# EAGLE design placappal (EAGLE 6.6.0)
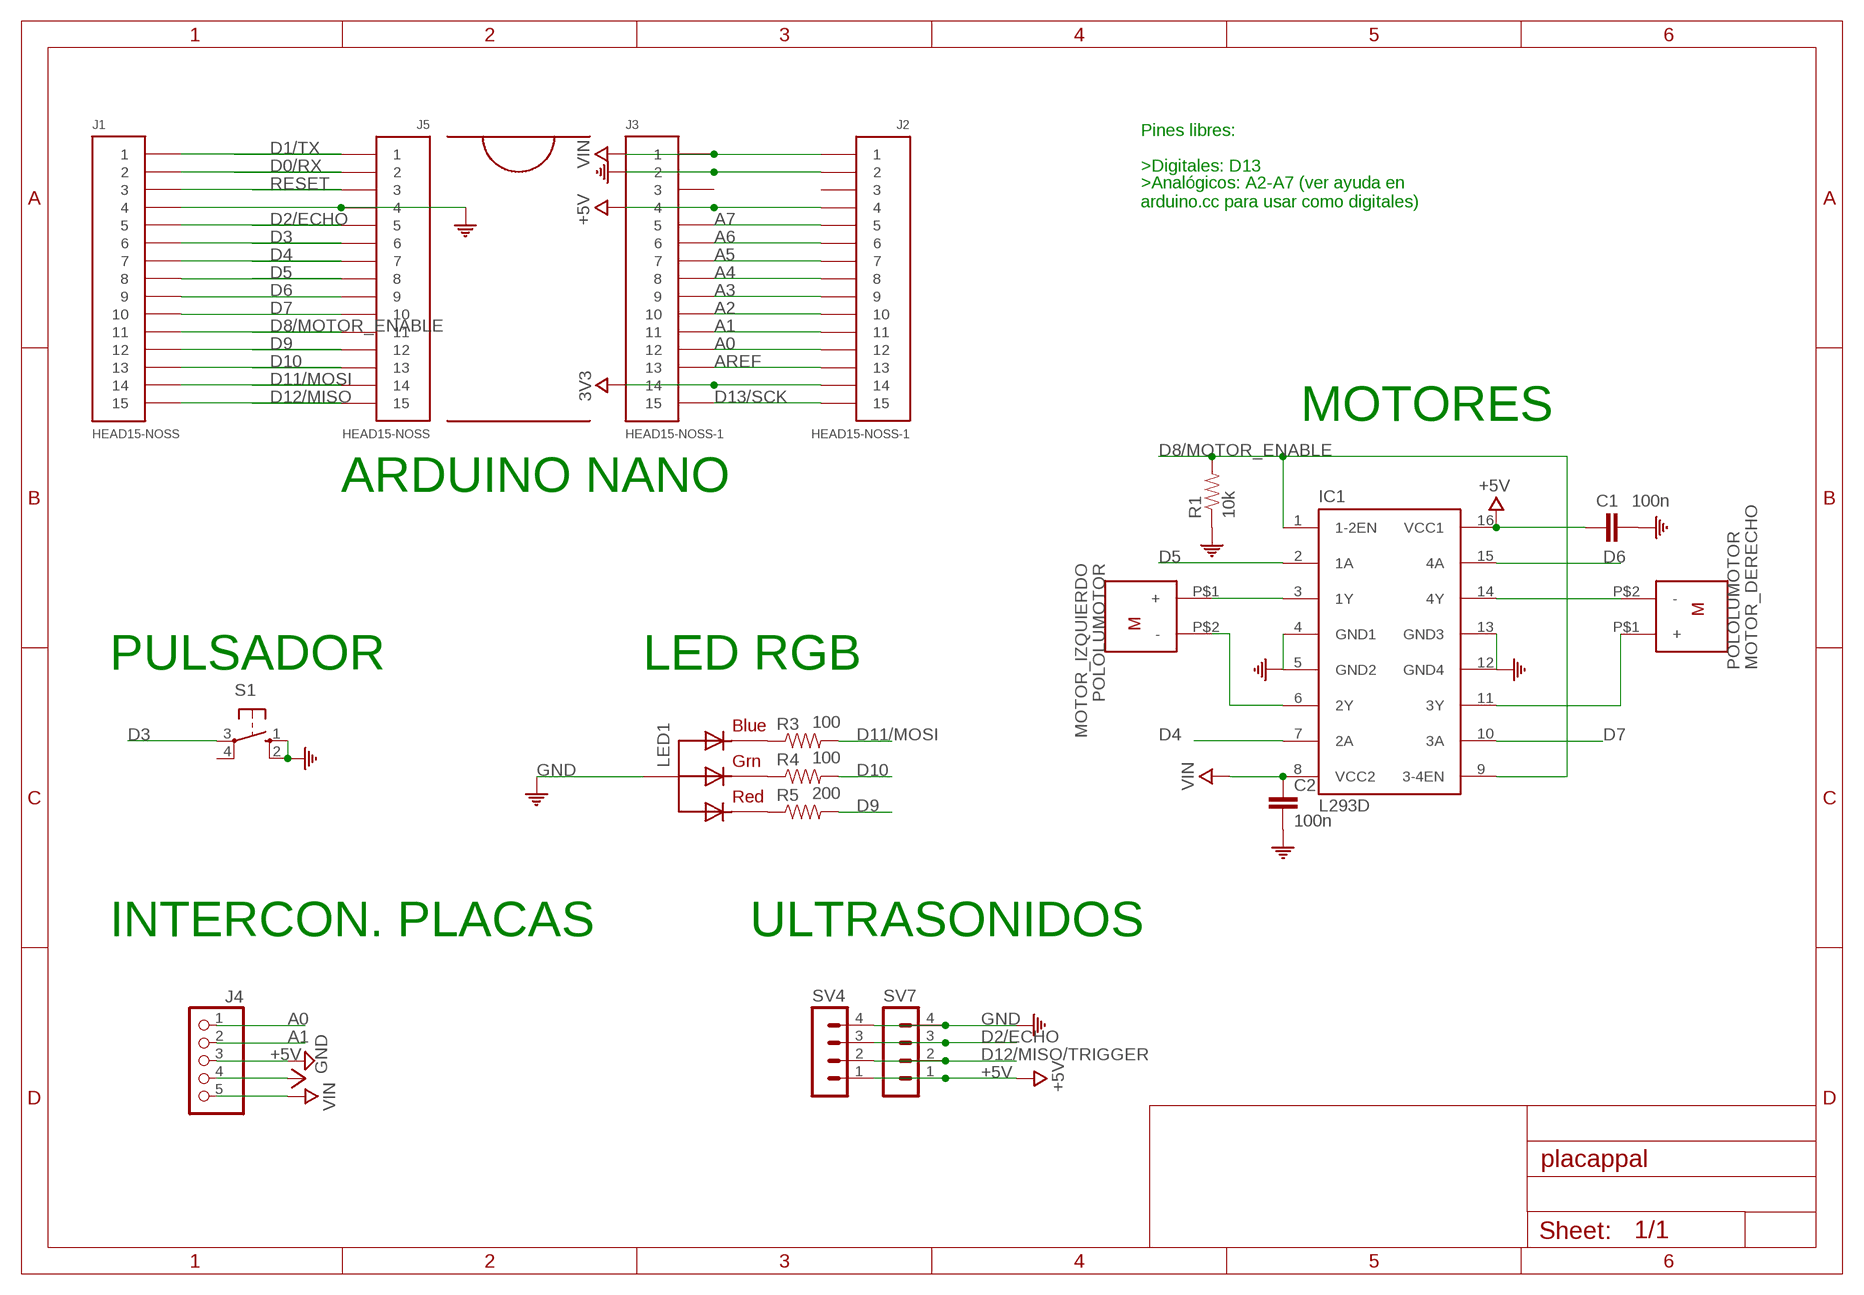
[diagram p0: schematic, sheet 1]

## Parts
C1  100n  CAP1206  [1206]
C2  100n  CAP1206  [1206]
IC1  L293D  [DIL16]
J1  HEAD15-NOSS  [HEAD15-NOSS]
J2  HEAD15-NOSS-1  [HEAD15-NOSS-1]
J3  HEAD15-NOSS-1  [HEAD15-NOSS-1]
J4  PINHD-1X5  [1X05]
J5  HEAD15-NOSS  [HEAD15-NOSS]
LED1  RGBLED_CA-5MM  [LED5MMRGB]
MOTOR_DERECHO  POLOLUMOTOR  [N20MOTOR]
MOTOR_IZQUIERDO  POLOLUMOTOR  [N20MOTOR]
R1  10k  RESISTOR1206  [1206]
R3  100  RESISTOR1206  [1206]
R4  100  RESISTOR1206  [1206]
R5  200  RESISTOR1206  [1206]
S1  10-XX  [B3F-10XX]
SV4  MA04-1  [MA04-1]
SV7  MA04-1  [MA04-1]

## Nets
3V3: J2.14 J3.14
+5V: C1.2 IC1.16(VCC1) J2.4 J3.4 J4.4 SV4.1 SV7.1
A0: J2.12 J3.12 J4.1
A1: J2.11 J3.11 J4.2
A2: J2.10 J3.10
A3: J2.9 J3.9
A4: J2.8 J3.8
A5: J2.7 J3.7
A6: J2.6 J3.6
A7: J2.5 J3.5
AREF: J2.13 J3.13
D0/RX: J1.2 J5.2
D1/TX: J1.1 J5.1
D2/ECHO: J1.5 J5.5 SV4.3 SV7.3
D3: J1.6 J5.6 S1.3(P)
D4: IC1.7(2A) J1.7 J5.7
D5: IC1.2(1A) J1.8 J5.8
D6: IC1.15(4A) J1.9 J5.9
D7: IC1.10(3A) J1.10 J5.10
D8/MOTOR_ENABLE: IC1.1(1-2EN) IC1.9(3-4EN) J1.11 J5.11 R1.2
D9: J1.12 J5.12 R5.2
D10: J1.13 J5.13 R4.2
D11/MOSI: J1.14 J5.14 R3.2
D12/MISO: J1.15 J5.15
D12/MISO/TRIGGER: SV4.2 SV7.2
D13/SCK: J2.15 J3.15
GND: C1.1 C2.2 IC1.4(GND1) IC1.5(GND2) IC1.12(GND4) IC1.13(GND3) J1.4 J2.2 J3.2 J4.3 J5.4 LED1.2(VCC) R1.1 S1.1(S) S1.2(S1) SV4.4 SV7.4 ; supply symbol labelled COM
N$1: IC1.3(1Y) MOTOR_IZQUIERDO.P$1(+)
N$4: IC1.6(2Y) MOTOR_IZQUIERDO.P$2(-)
N$5: IC1.14(4Y) MOTOR_DERECHO.P$2(-)
N$6: IC1.11(3Y) MOTOR_DERECHO.P$1(+)
N$7: LED1.4(BLUE) R3.1
N$8: LED1.3(GREEN) R4.1
N$9: LED1.1(RED) R5.1
RESET: J1.3 J5.3
VIN: C2.1 IC1.8(VCC2) J2.1 J3.1 J4.5
Unconnected: J2.3 J3.3 S1.4(P1)

## Notes on the sheet
- Pines libres:
- >Digitales: D13
- >Analógicos: A2-A7 (ver ayuda en 
  arduino.cc para usar como digitales)
- MOTORES
- ARDUINO NANO
- PULSADOR | LED RGB
- INTERCON. PLACAS | ULTRASONIDOS

## Library data of the parts
C1 C2 = SparkFun-Passives:CAP: Capacitor Standard 0603 ceramic capacitor, and 0.1" leaded capacitor.
IC1 = st-microelectronics:L293D: PUSH-PULL 4 CHANNEL DRIVER; MPN: L293D; OC_FARNELL: 9589619; OC_NEWARK: 56P8249
J1 J5 = MyCON2:HEAD15-NOSS
J2 J3 = MyCON2:HEAD15-NOSS-1
J4 = pinhead:PINHD-1X5: PIN HEADER
LED1 = adafruit:RGBLED_CA: RGB LED, common-anode 5MM Staggered pins 5mm Piranha package http://www.ladyada.net/library/pcb/eaglelibrary.html
MOTOR_DERECHO MOTOR_IZQUIERDO = Sumobot:POLOLUMOTOR
R1 R3-R5 = SparkFun-Passives:RESISTOR: Resistor Basic schematic elements and footprints for 0603, 1206, and PTH resistors.
S1 = switch-omron:10-XX: OMRON SWITCH
SV4 SV7 = con-lstb:MA04-1: PIN HEADER; OC_FARNELL: unknown; OC_NEWARK: unknown

## Net classes
1 power: width 0.61 mm, drill 0.61 mm, clearance 0.254 mm
2 gnd: width 0.305 mm, drill 0.559 mm, clearance 0.254 mm
3 usbvcc: width 0.508 mm, drill 0.61 mm, clearance 0.254 mm
4 aref: width 0.406 mm, drill 0.61 mm, clearance 0.254 mm

## Board
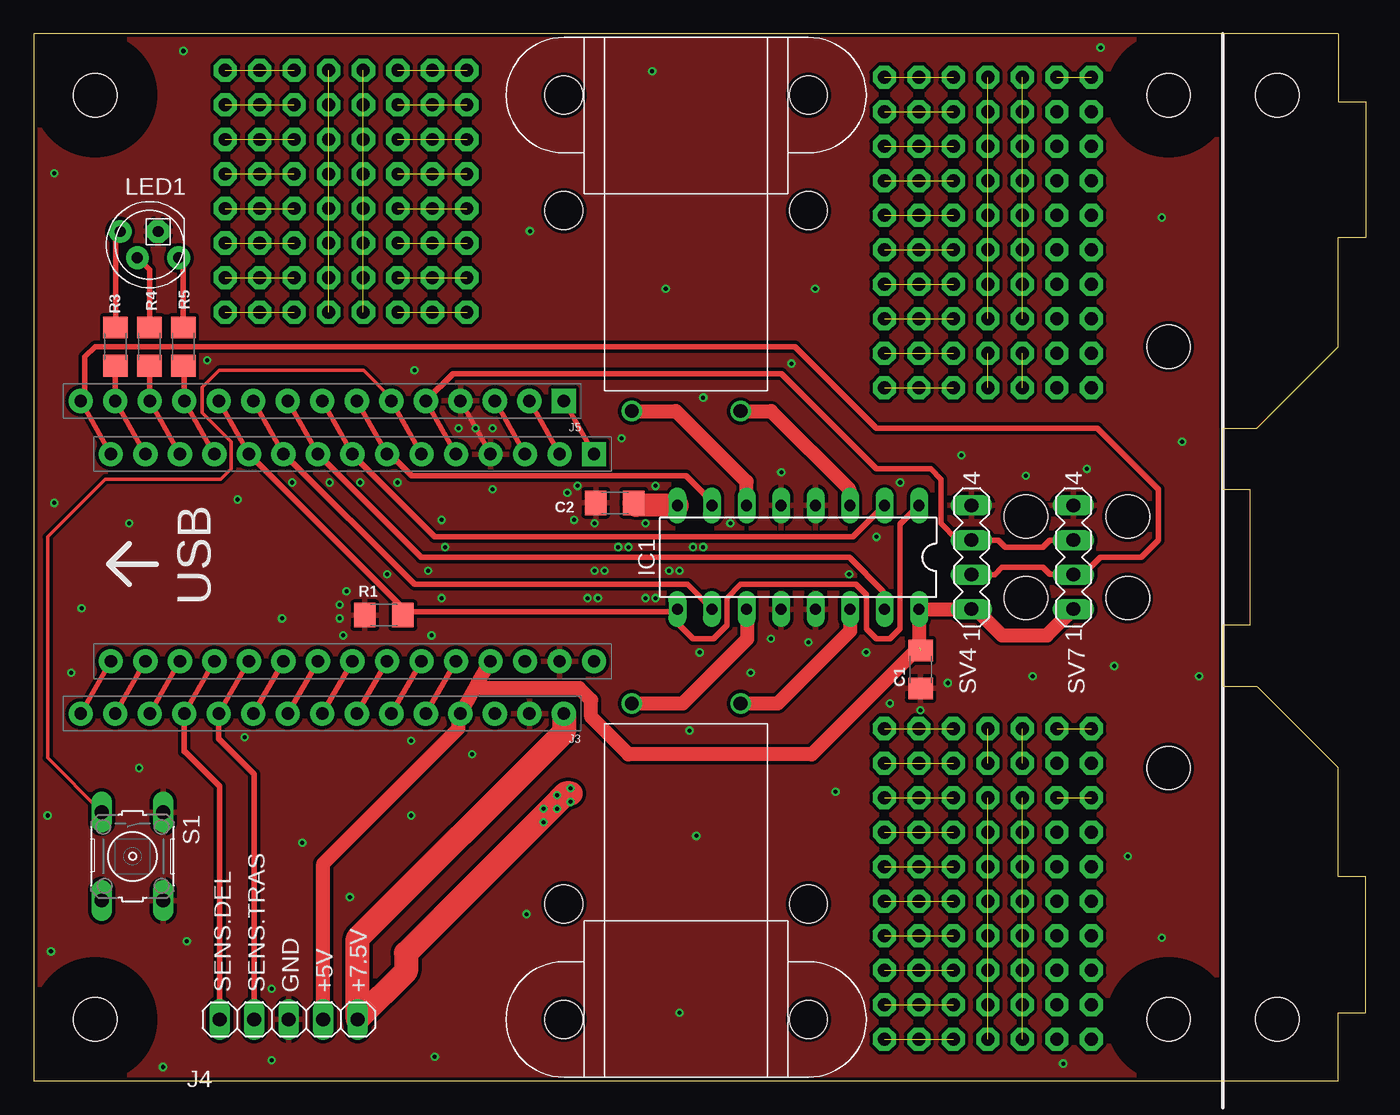
[diagram p1: board, top side]
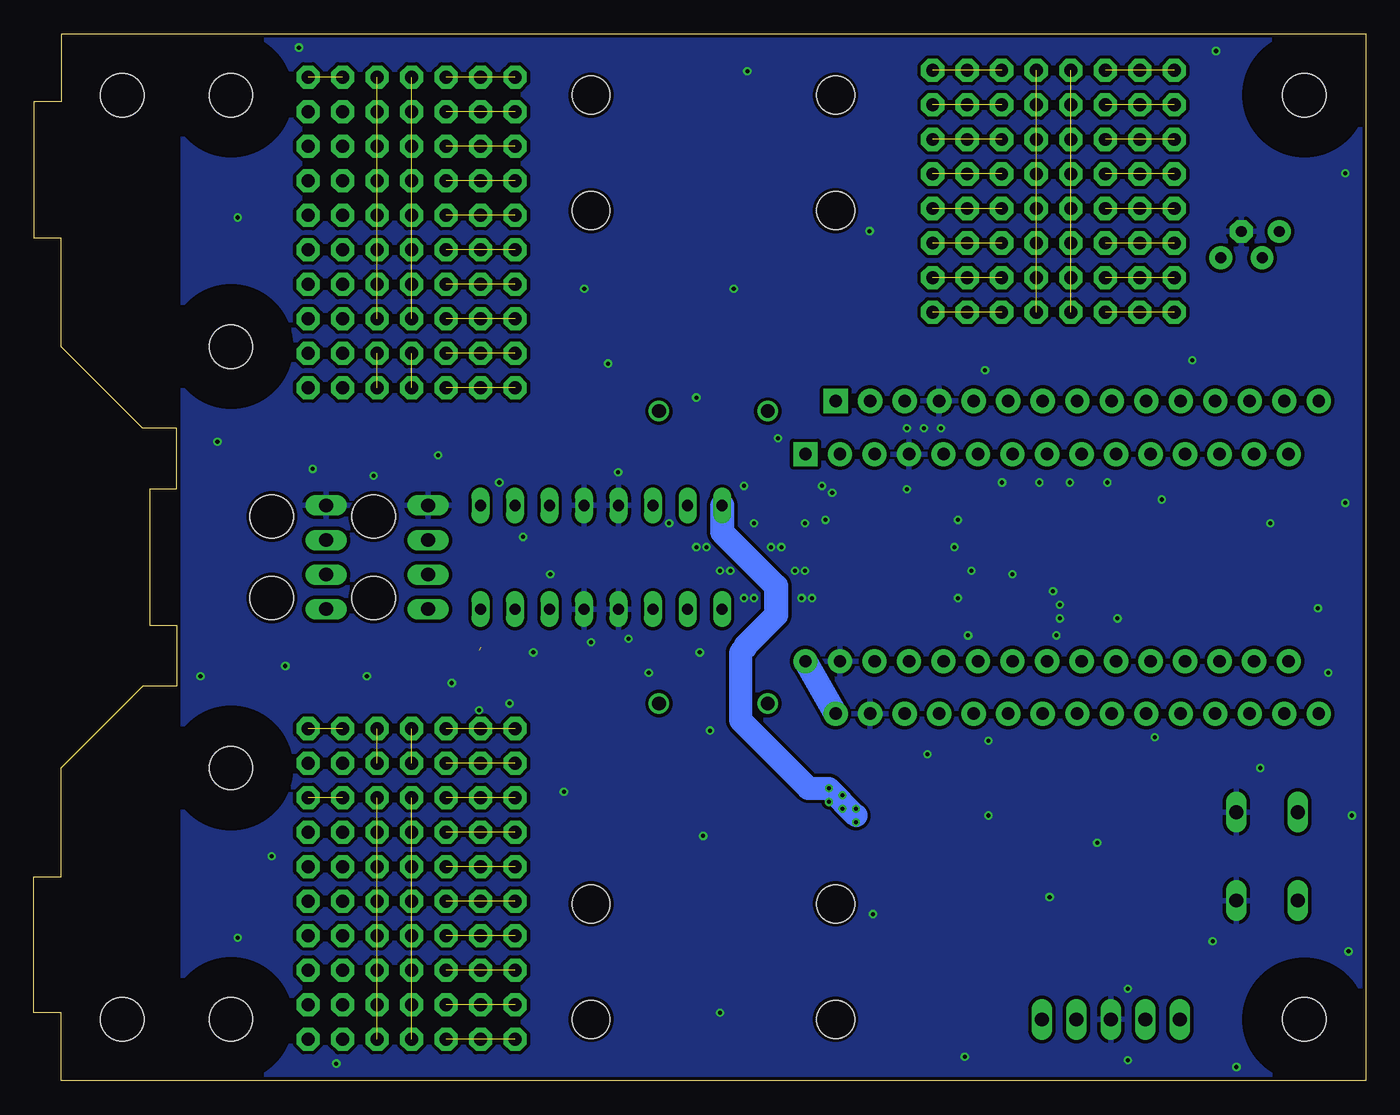
[diagram p2: board, bottom side, seen from below]

Size 98 x 77 mm. Coordinates in mm from the lower left corner, seen from the top.
Outline: 0,0 96,0 96,5 98,5 98,15 96,15 96,23 90,29 87.5,29 87.5,33.5 89.5,33.5 89.5,43.5 87.5,43.5 87.5,48 90,48 96,54 96,62 98,62 98,72 96,72 96,77 0,77 0,0
Copper layers (1*16): Top 0.035mm / dielectric 1.5mm / Bottom 0.035mm
Design rules "Fusion_eagle_rule_v1.1": minimum track width 6mil, minimum drill 0.3mm, track to track 6mil, track to pad 6mil, pad to pad 6mil, via to via 6mil, smd to smd 0mil, copper to edge 10mil, drill to drill 10mil, minimum pad ring 10mil, minimum via ring 6mil, stop-mask expansion 2mil, vias tented up to drill 100mil, thermal gap 10mil
Holes 3.2 mm at 4.5,72.5 83.5,72.5 4.5,4.5 83.5,4.5 83.5,23 83.5,54 73,41.5 73,35.5 80.5,35.5 80.5,41.5 91.5,72.5 91.5,4.5
Holes 2.8 mm at 39,64 57,64 39,13 57,13
tRestrict: area 0.5,68.5 to 8.5,76.5; area 0.5,0.5 to 8.5,8.5; area 79.5,68.5 to 87.5,76.5; area 79.5,0.5 to 87.5,8.5
bRestrict: area 0.5,0.5 to 8.5,8.5; area 0.5,68.5 to 8.5,76.5; area 79.5,0.5 to 87.5,8.5; area 79.5,68.5 to 87.5,76.5; area 79.5,50 to 87.5,58; area 79.5,19 to 87.5,27; area 87.5,68.5 to 95.5,76.5; area 87.5,0.5 to 95.5,8.5

### Footprints (pad centres in the part's own frame; a part is rotated, then mirrored left to right if it is on the bottom)
1206 = smd 1.6 x 1.8: 1 -1.4,0; 2 1.4,0
DIL16 = drill 0.813 long: 1 -8.89,-3.81; 2 -6.35,-3.81; 3 -3.81,-3.81; 4 -1.27,-3.81; 5 1.27,-3.81; 6 3.81,-3.81; 7 6.35,-3.81; 8 8.89,-3.81; 9 8.89,3.81; 10 6.35,3.81; 11 3.81,3.81; 12 1.27,3.81; 13 -1.27,3.81; 14 -3.81,3.81; 15 -6.35,3.81; 16 -8.89,3.81
HEAD15-NOSS = drill 0.914 pad 1.778 square: 1 0,0 | drill 0.914 pad 1.778: 2 2.54,0; 3 5.08,0; 4 7.62,0; 5 10.16,0; 6 12.7,0; 7 15.24,0; 8 17.78,0; 9 20.32,0; 10 22.86,0; 11 25.4,0; 12 27.94,0; 13 30.48,0; 14 33.02,0; 15 35.56,0
HEAD15-NOSS-1 = drill 0.914 pad 1.778: 1 0,0; 2 2.54,0; 3 5.08,0; 4 7.62,0; 5 10.16,0; 6 12.7,0; 7 15.24,0; 8 17.78,0; 9 20.32,0; 10 22.86,0; 11 25.4,0; 12 27.94,0; 13 30.48,0; 14 33.02,0; 15 35.56,0
1X05 = drill 1.016 long: 1 -5.08,0; 2 -2.54,0; 3 0,0; 4 2.54,0; 5 5.08,0
LED5MMRGB = drill 0.8 pad 1.676: 1 -2.159,0.968; 3 0.889,0.968; 4 2.159,-0.968 | drill 0.8 pad 1.676 octagon: 2 -0.635,-0.968
N20MOTOR = drill 1: P$1 -4,14.5; P$2 4,14.5 | hole 2.8: -9,-8.75; 9,-8.75
B3F-10XX = drill 1.016 long: 1 -3.251,2.261; 2 3.251,2.261; 3 -3.251,-2.261; 4 3.251,-2.261
MA04-1 = drill 1.016 long: 1 -3.81,0; 2 -1.27,0; 3 1.27,0; 4 3.81,0

### Placement (x,y rotation side)
C1  65.25,30.25 90 top
C2  42.75,42.5 180 top
IC1  56.25,38.5 180 top
J1  41.22,46.09 180 top
J2  41.22,30.85 180 top
J3  39,27 180 top
J4  18.75,4.5 0 top
J5  39,50 180 top
LED1  8.5,61.5 180 top
MOTOR_DERECHO  48,13.25 0 top
MOTOR_IZQUIERDO  48,63.75 180 top
R1  25.75,34.25 0 top
R3  6,54 270 top
R4  8.5,54 270 top
R5  11,54 270 top
S1  7.25,16.5 270 top
SV4  69,38.5 90 top
SV7  76.5,38.5 90 top

### Tracks (layer width: path | path; a pad name or v marks a point on that pad's centre or on a via)
3V3
  Top 0.406: J2.14 J3.14
+5V  (1 unrouted)
  Top 1.016: SV7.1 74.56,32.75 71.25,32.75 69.31,34.69 SV4.1 IC1.16 65.14,31.89 57.25,24 43.75,24 41,26.75 41,28 40.12,28.88 32.91,28.88 32.63,29.16 | 32.63,29.16 J3.4 31.25,26.87 31.25,25.92 21.29,15.96 J4.4 | 32.63,29.16 J2.4
+5V1  (via drill 0.95 pad 1.7)  (7 unrouted)
  other vias: 21.7,74.32 21.7,71.78 21.7,69.24 21.7,66.7 21.7,64.16 21.7,61.62 21.7,59.08 21.7,56.54
+5V2  (via drill 0.95 pad 1.7)  (7 unrouted)
  other vias: 70.2,73.82 70.2,71.28 70.2,68.74 70.2,66.2 70.2,63.66 70.2,61.12 70.2,58.58 70.2,56.04
+5V4  (via drill 0.95 pad 1.7)  (7 unrouted)
  other vias: 70.2,20.82 70.2,18.28 70.2,15.74 70.2,13.2 70.2,10.66 70.2,8.12 70.2,5.58 70.2,3.04
+5V5  (via drill 0.95 pad 1.7)  (1 unrouted)
  other vias: 70.2,25.9 70.2,23.36
+5V6  (via drill 0.95 pad 1.7)  (1 unrouted)
  other vias: 70.2,53.5 70.2,50.96
A0
  Top 0.406: J2.12 J3.12 11.06,24.25 | 11.06,24.25 11.06,24.19 | J4.1 13.67,21.64 11.06,24.25
A1
  Top 0.406: J4.2 16.21,22.54 13.6,25.15 J3.11 15.75,30.78 J2.11
A2
  Top 0.406: J2.10 J3.10
A3
  Top 0.406: J2.9 J3.9
A4
  Top 0.406: J2.8 J3.8
A5
  Top 0.406: J2.7 J3.7
A6
  Top 0.406: J2.6 J3.6
A7
  Top 0.406: J2.5 J3.5
AREF
  Top 0.406: J2.13 J3.13
D0/RX
  Top 0.406: J5.2 J1.2
D1/TX
  Top 0.406: J5.1 J1.1
D2/ECHO
  Top 0.406: J1.5 J5.5 30.84,52 55,52 62,45 66,45 66.75,44.25 66.75,41 67.98,39.77 SV4.3 70.98,39.77 71.5,39.25 74.25,39.25 74.75,39.75 76.48,39.75 SV7.3
D3
  Top 0.254: J5.6 26.3,50.2 24.25,52.25 13.62,52.25 12.38,51 12.38,49.12 14.5,47 14.5,45 13.75,44.25 5.25,44.25 1,40 1,23.74 S1.3
  Top 0.406: J5.6 J1.6
D4
  Top 0.406: 26.48,45.52 J1.7 25.69,46.61 | J5.7 25.69,46.61 | IC1.7 49.9,42.6 48,44.5 27.79,44.5 25.69,46.61
D5
  Top 0.406: IC1.2 60.29,40 29.5,40 23.44,46.06 J1.8 J5.8
D6
  Top 0.406: IC1.15 62.5,34.79 62.5,36 60,38.5 28.5,38.5 J1.9 J5.9
D7
  Top 0.406: IC1.10 48.09,36.5 28,36.5 18.41,46.09 J1.10 J5.10
D8/MOTOR_ENABLE
  Top 0.406: 27.2,34.7 27.41,34.5 47.5,34.5 47.31,34.69 IC1.9 47.36,33.64 48.5,32.5 50,32.5 51,33.5 51,35.5 52,36.5 60.5,36.5 61.25,35.75 61.25,33.25 62,32.5 63,32.5 63.75,33.25 63.75,40.92 IC1.1 | 27.2,34.7 J1.11 J5.11 | R1.2 27.15,34.65 27.2,34.7
D9
  Top 0.406: J1.12 J5.12 11.06,52.54 R5.2
D10
  Top 0.406: J1.13 J5.13 8.52,52.58 R4.2
D11/MOSI
  Top 0.406: J1.14 J5.14 5.98,52.58 R3.2
D12/MISO
  Top 0.406: 76.52,37.25 77.25,37.25 78.5,38.5 81.5,38.5 82.75,39.75 82.75,43.5 78.25,48 62,48 56,54 4.5,54 3.75,53.25 3.75,50.31 J5.15 J1.15
D12/MISO/TRIGGER
  Top 0.406: SV4.2 70.73,37.23 71.25,37.75 74.25,37.75 74.75,37.25 76.48,37.25 SV7.2
D13/SCK
  Top 0.406: J2.15 J3.15
GND  (via drill 0.3)
  Top 0.406: 38.15,31.38 J2.2 | J5.4 J1.4
  other vias: 40,43.75 39.25,43.25 39.75,41.25 41.25,41 45,41 45.75,43.75 31.25,48 33.75,48 32.5,48 19,44 26,37.25 30,35.5 41.5,35.5 42,37.5 43.75,39.25 40.75,35.5 41.25,37.5 43,39.25 48.5,39.25 49.25,39.25 46.75,37.5 47.5,37.5 45,35.5 45.75,35.5 29,37.5 30.25,39.25 24,44 21.75,44 60,37.25 62,40 26.75,44 30,41.25 33.75,43.5 23,36 22.5,35 22.5,34 22.75,32.75 15.5,25.25 27.75,25 19.75,17.5 17.5,1.5 17.5,6.75 1.25,9.5 9.5,1 11.25,10.25 1,19.5 3.5,34.75 15,42.75 18.25,34 1.5,42.5 29.5,1.75 59,21.25 48.75,18 36.25,12.25 47.5,5 80.5,16.5 83,10.5 75.75,1.25 85.75,29.75 73.5,29.75 67.25,29.25 63,27.75 65.25,27.25 48.25,25.75 61.25,31.5 54.25,32.5 52.75,30 57,32.25 49,31.5 29.25,32.75 7,41 1.5,66.75 11,75.75 36.5,62.5 28,52.25 12.75,53 51.25,41 43.25,47.25 49.25,50.25 63.75,44 55,44.75 55.75,52.75 77.5,45 68.25,46 73,44.5 79.5,30.5 84.5,47 57.5,58.25 45.5,74.25 46.5,58.25 83,63.5 78.5,76 32.25,24 27.75,19.5 23.25,13.5 7.75,23 2.75,30
  pour Top (isolate 0.25): 5.75,78.75 -1,78.75 -1.5,-1 87,-2.5 87,77.5 5.5,79
  pour Bottom (isolate 0.25): 0,78.25 -2.25,78.25 -3.25,-8.5 87,-2.5 87,77.25 7.75,80.75 1.75,78.75
GND1  (via drill 0.95 pad 1.7)  (7 unrouted)
  other vias: 24.24,74.32 24.24,71.78 24.24,69.24 24.24,66.7 24.24,64.16 24.24,61.62 24.24,59.08 24.24,56.54
GND2  (via drill 0.95 pad 1.7)  (7 unrouted)
  other vias: 72.74,73.82 72.74,71.28 72.74,68.74 72.74,66.2 72.74,63.66 72.74,61.12 72.74,58.58 72.74,56.04
GND4  (via drill 0.95 pad 1.7)  (7 unrouted)
  other vias: 72.74,20.82 72.74,18.28 72.74,15.74 72.74,13.2 72.74,10.66 72.74,8.12 72.74,5.58 72.74,3.04
GND5  (via drill 0.95 pad 1.7)  (1 unrouted)
  other vias: 72.74,25.9 72.74,23.36
GND6  (via drill 0.95 pad 1.7)  (1 unrouted)
  other vias: 72.74,53.5 72.74,50.96
N$1
  Top 1.016: MOTOR_IZQUIERDO.P$1 54.25,49.25 60,43.5 60,42.37 IC1.3
N$4
  Top 1.016: IC1.6 52.44,44.06 47.25,49.25 MOTOR_IZQUIERDO.P$2
N$5
  Top 1.016: IC1.14 60.06,33.06 54.75,27.75 MOTOR_DERECHO.P$2
N$6
  Top 1.016: MOTOR_DERECHO.P$1 47.75,27.75 52.5,32.5 52.5,34.63 IC1.11
N$7
  Top 0.406: LED1.4 6,62.13 R3.1
N$8
  Top 0.406: LED1.3 8.5,59.64 R4.1
N$9
  Top 0.406: R5.1 11,60.19 LED1.1
N$151  (via drill 0.95 pad 1.7)
  other vias: 29.32,61.62
N$152  (via drill 0.95 pad 1.7)  (1 unrouted)
  other vias: 26.78,61.62 31.86,61.62
N$154  (via drill 0.95 pad 1.7)  (1 unrouted)
  other vias: 19.16,61.62 14.08,61.62
N$157  (via drill 0.95 pad 1.7)
  other vias: 16.62,61.62
N$158  (via drill 0.95 pad 1.7)  (1 unrouted)
  other vias: 31.86,64.16 26.78,64.16
N$159  (via drill 0.95 pad 1.7)
  other vias: 29.32,64.16
N$160  (via drill 0.95 pad 1.7)
  other vias: 16.62,64.16
N$161  (via drill 0.95 pad 1.7)  (1 unrouted)
  other vias: 14.08,64.16 19.16,64.16
N$162  (via drill 0.95 pad 1.7)
  other vias: 29.32,66.7
N$163  (via drill 0.95 pad 1.7)  (1 unrouted)
  other vias: 26.78,66.7 31.86,66.7
N$164  (via drill 0.95 pad 1.7)  (1 unrouted)
  other vias: 19.16,66.7 14.08,66.7
N$166  (via drill 0.95 pad 1.7)
  other vias: 16.62,66.7
N$169  (via drill 0.95 pad 1.7)  (1 unrouted)
  other vias: 31.86,69.24 26.78,69.24
N$170  (via drill 0.95 pad 1.7)
  other vias: 29.32,69.24
N$171  (via drill 0.95 pad 1.7)
  other vias: 16.62,69.24
N$172  (via drill 0.95 pad 1.7)  (1 unrouted)
  other vias: 14.08,69.24 19.16,69.24
N$173  (via drill 0.95 pad 1.7)
  other vias: 29.32,71.78
N$174  (via drill 0.95 pad 1.7)  (1 unrouted)
  other vias: 26.78,71.78 31.86,71.78
N$175  (via drill 0.95 pad 1.7)
  other vias: 16.62,71.78
N$183  (via drill 0.95 pad 1.7)  (1 unrouted)
  other vias: 14.08,59.08 19.16,59.08
N$184  (via drill 0.95 pad 1.7)
  other vias: 16.62,59.08
N$185  (via drill 0.95 pad 1.7)
  other vias: 16.62,56.54
N$186  (via drill 0.95 pad 1.7)  (1 unrouted)
  other vias: 19.16,56.54 14.08,56.54
N$187  (via drill 0.95 pad 1.7)  (1 unrouted)
  other vias: 26.78,56.54 31.86,56.54
N$188  (via drill 0.95 pad 1.7)
  other vias: 29.32,59.08
N$193  (via drill 0.95 pad 1.7)
  other vias: 29.32,56.54
N$194  (via drill 0.95 pad 1.7)  (1 unrouted)
  other vias: 31.86,59.08 26.78,59.08
N$197  (via drill 0.95 pad 1.7)
  other vias: 16.62,74.32
N$199  (via drill 0.95 pad 1.7)  (2 unrouted)
  other vias: 31.86,74.32 29.32,74.32 26.78,74.32
N$200  (via drill 0.95 pad 1.7)  (1 unrouted)
  other vias: 19.16,71.78 14.08,71.78
N$202  (via drill 0.95 pad 1.7)  (1 unrouted)
  other vias: 19.16,74.32 14.08,74.32
N$204  (via drill 0.95 pad 1.7)
  other vias: 77.82,61.12
N$205  (via drill 0.95 pad 1.7)
  other vias: 75.28,61.12
N$206  (via drill 0.95 pad 1.7)  (1 unrouted)
  other vias: 67.66,61.12 62.58,61.12
N$207  (via drill 0.95 pad 1.7)
  other vias: 65.12,61.12
N$208  (via drill 0.95 pad 1.7)
  other vias: 75.28,63.66
N$209  (via drill 0.95 pad 1.7)
  other vias: 77.82,63.66
N$210  (via drill 0.95 pad 1.7)
  other vias: 65.12,63.66
N$211  (via drill 0.95 pad 1.7)  (1 unrouted)
  other vias: 62.58,63.66 67.66,63.66
N$212  (via drill 0.95 pad 1.7)
  other vias: 77.82,66.2
N$213  (via drill 0.95 pad 1.7)
  other vias: 75.28,66.2
N$214  (via drill 0.95 pad 1.7)  (1 unrouted)
  other vias: 67.66,66.2 62.58,66.2
N$215  (via drill 0.95 pad 1.7)
  other vias: 65.12,66.2
N$216  (via drill 0.95 pad 1.7)
  other vias: 75.28,68.74
N$217  (via drill 0.95 pad 1.7)
  other vias: 77.82,68.74
N$218  (via drill 0.95 pad 1.7)
  other vias: 65.12,68.74
N$219  (via drill 0.95 pad 1.7)  (1 unrouted)
  other vias: 62.58,68.74 67.66,68.74
N$220  (via drill 0.95 pad 1.7)
  other vias: 77.82,71.28
N$221  (via drill 0.95 pad 1.7)
  other vias: 75.28,71.28
N$224  (via drill 0.95 pad 1.7)
  other vias: 65.12,71.28
N$225  (via drill 0.95 pad 1.7)  (1 unrouted)
  other vias: 62.58,58.58 67.66,58.58
N$226  (via drill 0.95 pad 1.7)
  other vias: 65.12,58.58
N$244  (via drill 0.95 pad 1.7)
  other vias: 65.12,56.04
N$250  (via drill 0.95 pad 1.7)  (1 unrouted)
  other vias: 67.66,56.04 62.58,56.04
N$253  (via drill 0.95 pad 1.7)
  other vias: 75.28,56.04
N$254  (via drill 0.95 pad 1.7)
  other vias: 77.82,58.58
N$255  (via drill 0.95 pad 1.7)
  other vias: 77.82,56.04
N$256  (via drill 0.95 pad 1.7)
  other vias: 75.28,58.58
N$257  (via drill 0.95 pad 1.7)
  other vias: 65.12,73.82
N$258  (via drill 0.95 pad 1.7)  (1 unrouted)
  other vias: 77.82,73.82 75.28,73.82
N$260  (via drill 0.95 pad 1.7)  (1 unrouted)
  other vias: 67.66,71.28 62.58,71.28
N$264  (via drill 0.95 pad 1.7)  (1 unrouted)
  other vias: 67.66,73.82 62.58,73.82
N$265  (via drill 0.95 pad 1.7)
  other vias: 77.82,8.12
N$266  (via drill 0.95 pad 1.7)
  other vias: 75.28,8.12
N$287  (via drill 0.95 pad 1.7)  (1 unrouted)
  other vias: 67.66,8.12 62.58,8.12
N$288  (via drill 0.95 pad 1.7)
  other vias: 65.12,8.12
N$300  (via drill 0.95 pad 1.7)
  other vias: 75.28,10.66
N$301  (via drill 0.95 pad 1.7)
  other vias: 77.82,10.66
N$303  (via drill 0.95 pad 1.7)
  other vias: 65.12,10.66
N$306  (via drill 0.95 pad 1.7)  (1 unrouted)
  other vias: 62.58,10.66 67.66,10.66
N$328  (via drill 0.95 pad 1.7)
  other vias: 77.82,13.2
N$330  (via drill 0.95 pad 1.7)
  other vias: 75.28,13.2
N$333  (via drill 0.95 pad 1.7)  (1 unrouted)
  other vias: 67.66,13.2 62.58,13.2
N$334  (via drill 0.95 pad 1.7)
  other vias: 65.12,13.2
N$338  (via drill 0.95 pad 1.7)
  other vias: 75.28,15.74
N$339  (via drill 0.95 pad 1.7)
  other vias: 77.82,15.74
N$340  (via drill 0.95 pad 1.7)
  other vias: 65.12,15.74
N$342  (via drill 0.95 pad 1.7)  (1 unrouted)
  other vias: 62.58,15.74 67.66,15.74
N$343  (via drill 0.95 pad 1.7)
  other vias: 77.82,18.28
N$344  (via drill 0.95 pad 1.7)
  other vias: 75.28,18.28
N$345  (via drill 0.95 pad 1.7)
  other vias: 65.12,18.28
N$346  (via drill 0.95 pad 1.7)  (1 unrouted)
  other vias: 62.58,5.58 67.66,5.58
N$347  (via drill 0.95 pad 1.7)
  other vias: 65.12,5.58
N$348  (via drill 0.95 pad 1.7)
  other vias: 65.12,3.04
N$349  (via drill 0.95 pad 1.7)  (1 unrouted)
  other vias: 67.66,3.04 62.58,3.04
N$382  (via drill 0.95 pad 1.7)
  other vias: 75.28,3.04
N$384  (via drill 0.95 pad 1.7)
  other vias: 77.82,5.58
N$386  (via drill 0.95 pad 1.7)
  other vias: 77.82,3.04
N$387  (via drill 0.95 pad 1.7)
  other vias: 75.28,5.58
N$388  (via drill 0.95 pad 1.7)
  other vias: 65.12,20.82
N$389  (via drill 0.95 pad 1.7)  (1 unrouted)
  other vias: 77.82,20.82 75.28,20.82
N$390  (via drill 0.95 pad 1.7)  (1 unrouted)
  other vias: 67.66,18.28 62.58,18.28
N$391  (via drill 0.95 pad 1.7)  (1 unrouted)
  other vias: 67.66,20.82 62.58,20.82
N$392  (via drill 0.95 pad 1.7)
  other vias: 77.82,23.36
N$394  (via drill 0.95 pad 1.7)
  other vias: 75.28,23.36
N$437  (via drill 0.95 pad 1.7)
  other vias: 65.12,23.36
N$438  (via drill 0.95 pad 1.7)
  other vias: 65.12,25.9
N$439  (via drill 0.95 pad 1.7)  (1 unrouted)
  other vias: 77.82,25.9 75.28,25.9
N$440  (via drill 0.95 pad 1.7)  (1 unrouted)
  other vias: 67.66,23.36 62.58,23.36
N$441  (via drill 0.95 pad 1.7)  (1 unrouted)
  other vias: 67.66,25.9 62.58,25.9
N$442  (via drill 0.95 pad 1.7)  (1 unrouted)
  other vias: 62.58,53.5 67.66,53.5
N$443  (via drill 0.95 pad 1.7)
  other vias: 65.12,53.5
N$444  (via drill 0.95 pad 1.7)
  other vias: 65.12,50.96
N$445  (via drill 0.95 pad 1.7)  (1 unrouted)
  other vias: 67.66,50.96 62.58,50.96
N$446  (via drill 0.95 pad 1.7)
  other vias: 75.28,50.96
N$447  (via drill 0.95 pad 1.7)
  other vias: 77.82,53.5
N$448  (via drill 0.95 pad 1.7)
  other vias: 77.82,50.96
N$449  (via drill 0.95 pad 1.7)
  other vias: 75.28,53.5
RESET
  Top 0.406: J5.3 J1.3
VIN  (via drill 0.3)
  Top 0.406: 38.75,20.75 v38.5,21 v38.5,20 v37.5,20 v37.5,19 | v39.5,21.5 39.69,21.31 39.69,20.69 v39.5,20.5 39.5,21.12
  Top 1.676: IC1.8 44.34,42.31 C2.1
  Top 1.778: J3.1 39,25.62 23.83,10.46 J4.5 27.38,8.04 27.38,9.38 38.75,20.75 39.12,21.12 39.5,21.12
  Bottom 0.406: 37.5,19.12 v37.5,19
  Bottom 1.676: 45.62,32 45.62,31.88 46,31.5 46,26.5 41,21.5 v39.5,21.5 37.5,19.5
  Bottom 1.778: J2.1 J3.1 | IC1.8 47.36,40.36 43.38,36.38 43.38,34.25 45.62,32

### Text on the board
tPlace: USB | SENS.DEL | SENS.TRAS | GND | +5V | +7.5V